# Altium schematic sheet [28] - PWR 1V375 OPT, 3V3 OPT.SchDoc
size A2; DocumentNumber: 27; SheetNumber: 27; SheetTotal: 32
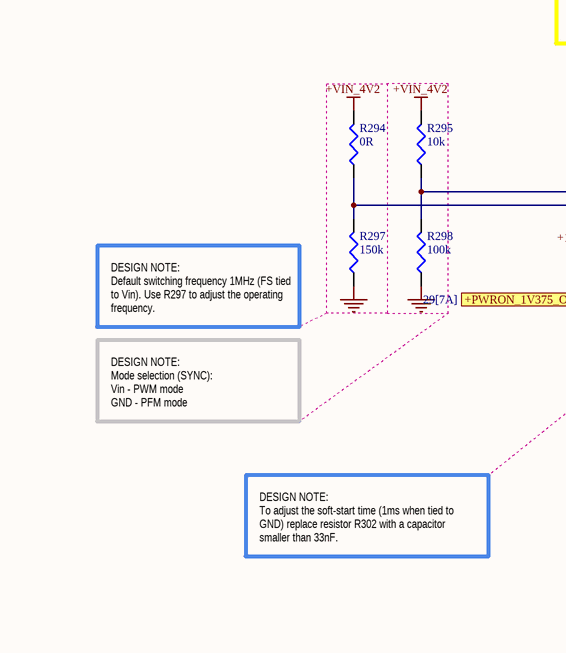
[diagram p0: [28] - PWR 1V375 OPT, 3V3 OPT.SchDoc, top left]
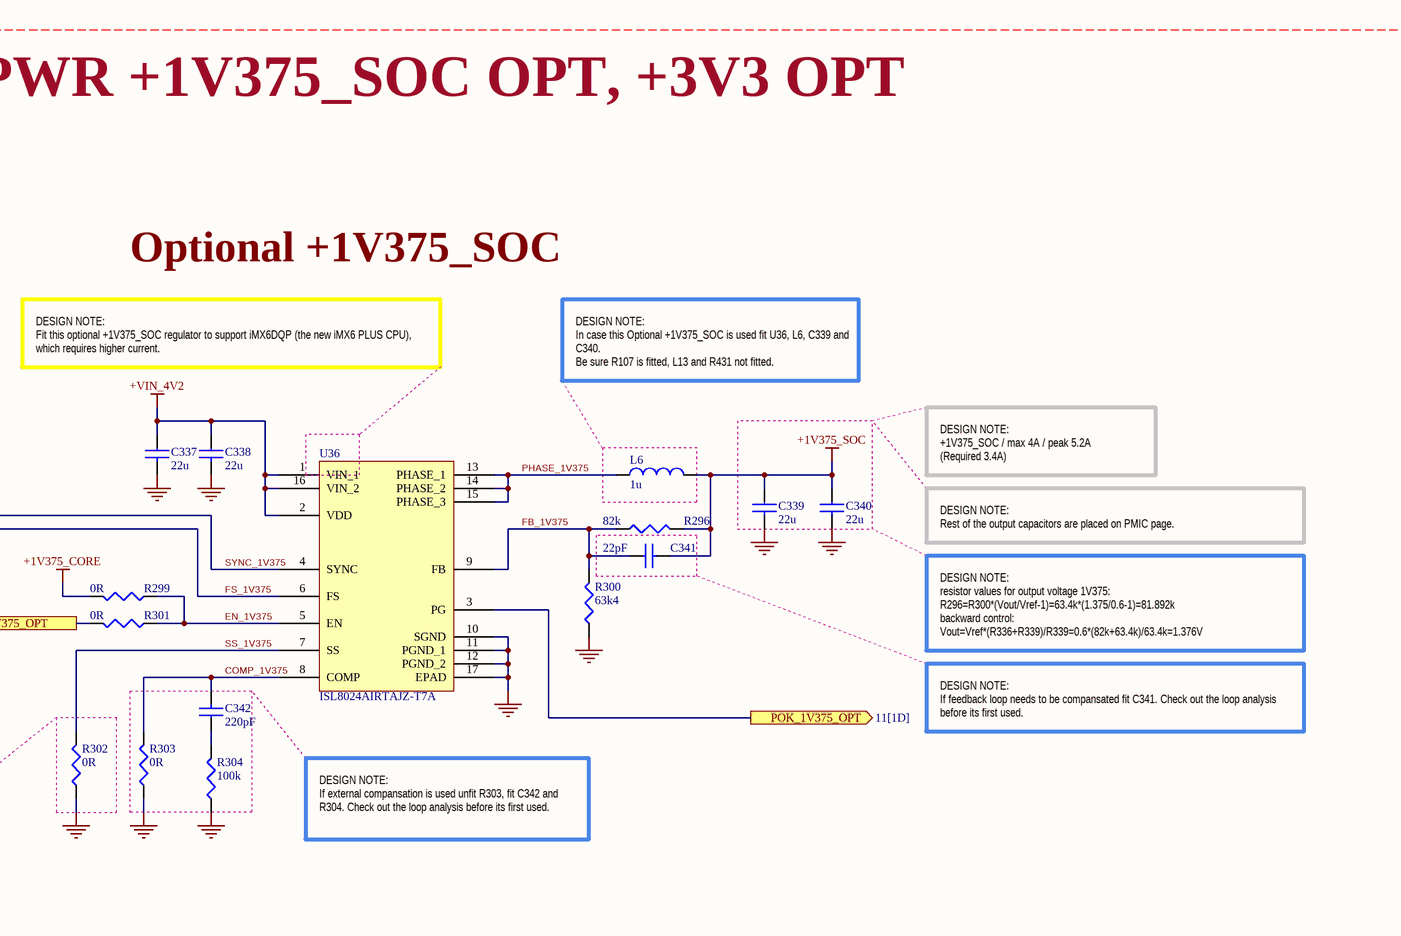
[diagram p1: [28] - PWR 1V375 OPT, 3V3 OPT.SchDoc, top right]
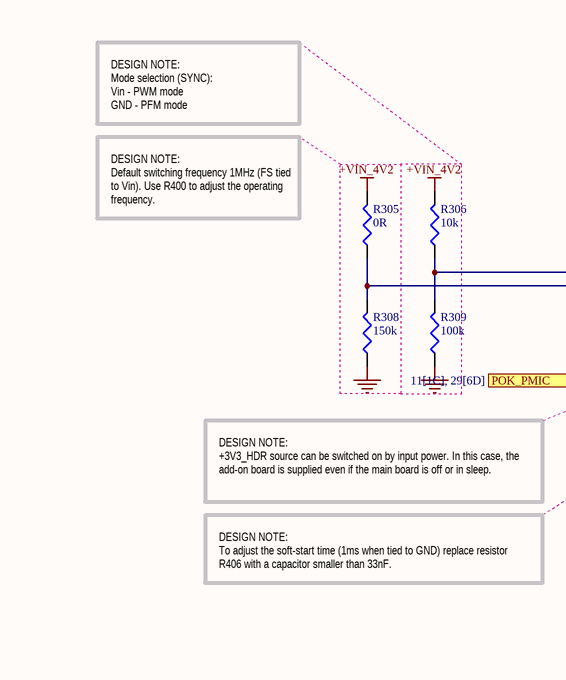
[diagram p2: [28] - PWR 1V375 OPT, 3V3 OPT.SchDoc, bottom left]
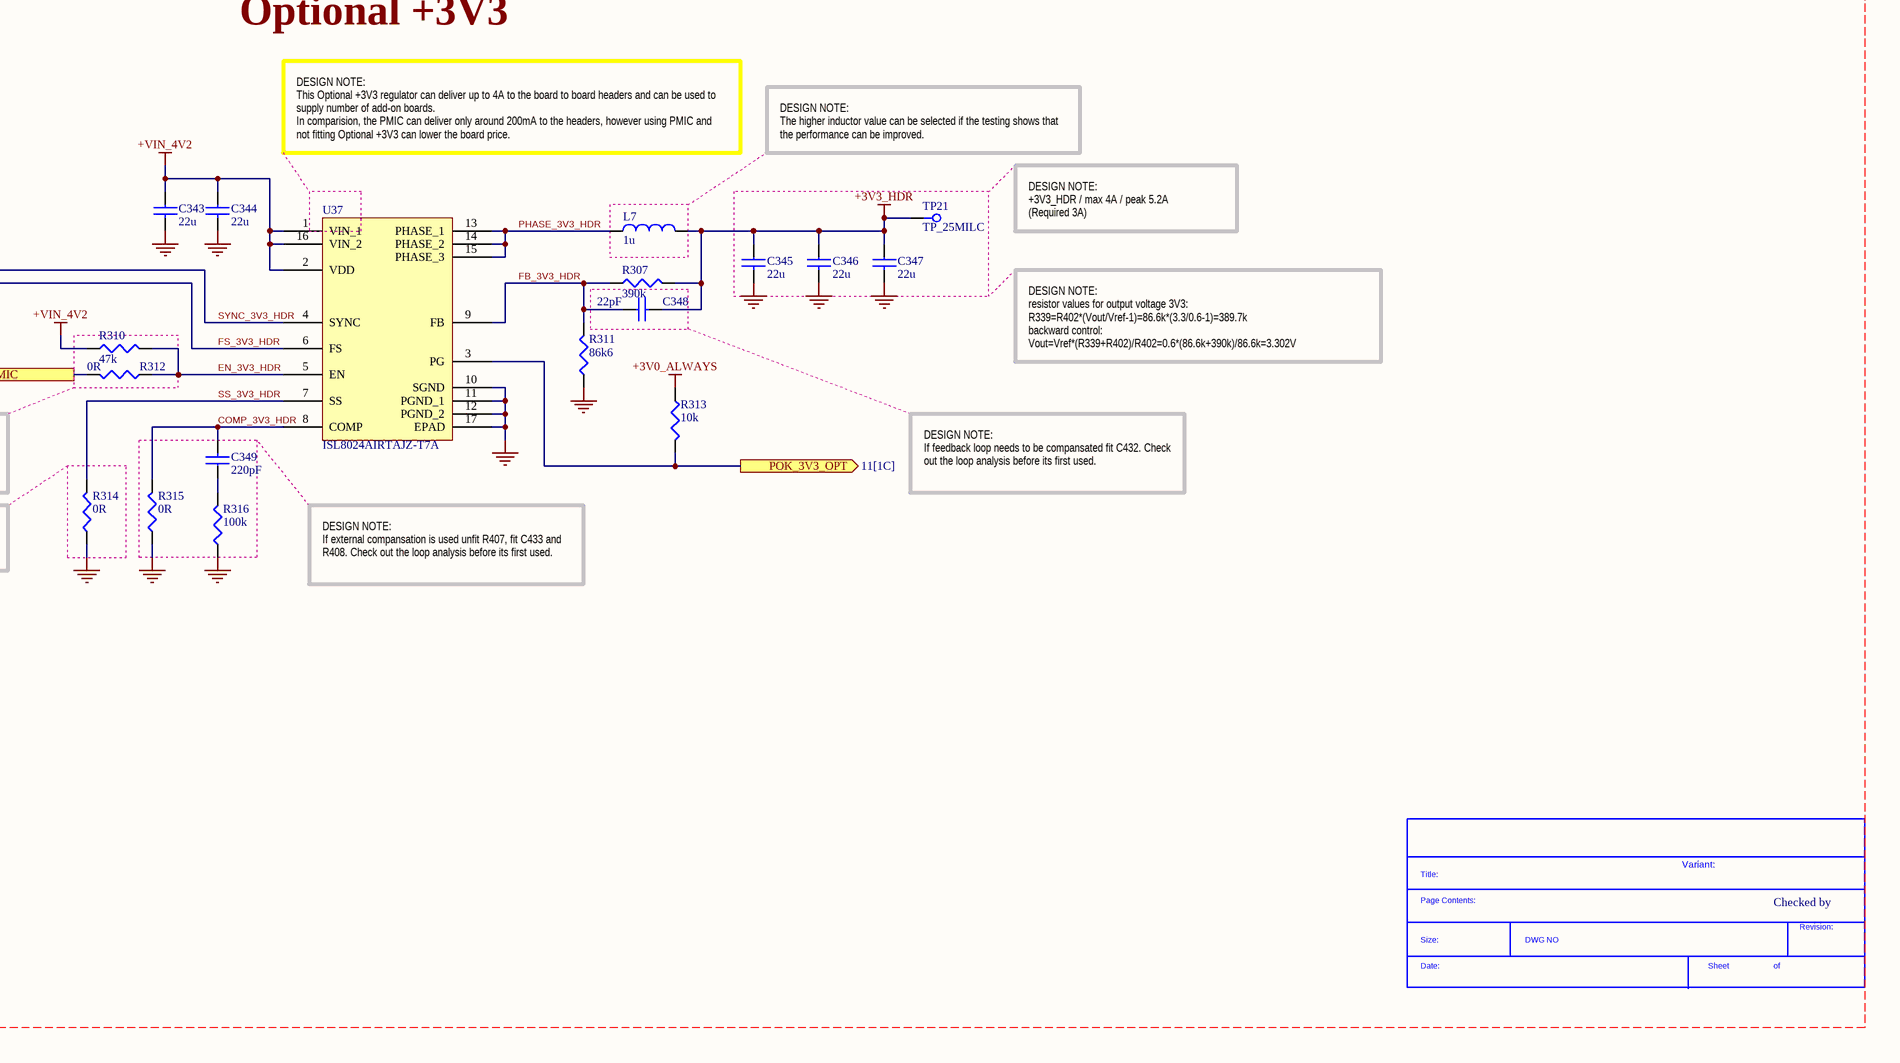
[diagram p3: [28] - PWR 1V375 OPT, 3V3 OPT.SchDoc, bottom right]

## Parts
*  SDTitleBlock  (value not drawn)  (graphical)
C337  22u  [C0603]
C338  22u  [C0603]
C339  22u  [C0603]
C340  22u  [C0603]
C341  22pF  [C0402]
C342  220pF  [C0402]
C343  22u  [C0603]
C344  22u  [C0603]
C345  22u  [C0603]
C346  22u  [C0603]
C347  22u  [C0603]
C348  22pF  [C0402]
C349  220pF  [C0402]
L6  1u  [IHLP_204MILX216MIL]
L7  1u  [IHLP_204MILX216MIL]
R294  0R  [R0402]
R295  10k  [R0402]
R296  82k  [R0402]
R297  150k  [R0402]
R298  100k  [R0402]
R299  0R  [R0402]
R300  63k4  [R0402]
R301  0R  [R0402]
R302  0R  [R0402]
R303  0R  [R0402]
R304  100k  [R0402]
R305  0R  [R0402]
R306  10k  [R0402]
R307  390k  [R0402]
R308  150k  [R0402]
R309  100k  [R0402]
R310  47k  [R0402]
R311  86k6  [R0402]
R312  0R  [R0402]
R313  10k  [R0402]
R314  0R  [R0402]
R315  0R  [R0402]
R316  100k  [R0402]
TP21  TP_25MILC  [TP_25C]  (no BOM)
U36  ISL8024AIRTAJZ-T7A  [16-TQFN_3mmx3mm_V1.1]
U37  ISL8024AIRTAJZ-T7A  [16-TQFN_3mmx3mm_V1.1]

## Ports
+PWRON_1V375_OPT (see 29[7A]), POK_1V375_OPT (out, see 11[1D]), POK_3V3_OPT (out, see 11[1C]), POK_PMIC (see 11[1C], 29[6D])

## Nets
+1V375_CORE: R299.2
+1V375_SOC: C339.1 C340.1 C341.2 L6.2 R296.2
+3V0_ALWAYS: R313.1
+3V3_HDR: C345.1 C346.1 C347.1 C348.2 L7.2 R307.2 TP21.1
+VIN_4V2: C337.1 C338.1 C343.1 C344.1 R294.2 R295.2 R305.2 R306.2 R310.1 U36.1(VIN_1) U36.2(VDD) U36.16(VIN_2) U37.1(VIN_1) U37.2(VDD) U37.16(VIN_2)
GND: C337.2 C338.2 C339.2 C340.2 C343.2 C344.2 C345.2 C346.2 C347.2 R297.1 R298.1 R300.1 R302.1 R303.1 R304.1 R308.1 R309.1 R311.1 R314.1 R315.1 R316.1 U36.10(SGND) U36.11(PGND_1) U36.12(PGND_2) U36.17(EPAD) U37.10(SGND) U37.11(PGND_1) U37.12(PGND_2) U37.17(EPAD)
+PWRON_1V375_OPT: R301.2 ; port +PWRON_1V375_OPT
COMP_1V375: C342.2 R303.2 U36.8(COMP)
COMP_3V3_HDR: C349.2 R315.2 U37.8(COMP)
EN_1V375: R299.1 R301.1 U36.5(EN)
EN_3V3_HDR: R310.2 R312.1 U37.5(EN)
FB_1V375: C341.1 R296.1 R300.2 U36.9(FB)
FB_3V3_HDR: C348.1 R307.1 R311.2 U37.9(FB)
FS_1V375: R294.1 R297.2 U36.6(FS)
FS_3V3_HDR: R305.1 R308.2 U37.6(FS)
PHASE_1V375: L6.1 U36.13(PHASE_1) U36.14(PHASE_2) U36.15(PHASE_3)
PHASE_3V3_HDR: L7.1 U37.13(PHASE_1) U37.14(PHASE_2) U37.15(PHASE_3)
POK_1V375_OPT: U36.3(PG) ; port POK_1V375_OPT
POK_3V3_OPT: R313.2 U37.3(PG) ; port POK_3V3_OPT
POK_PMIC: R312.2 ; port POK_PMIC
SS_1V375: R302.2 U36.7(SS)
SS_3V3_HDR: R314.2 U37.7(SS)
SYNC_1V375: R295.1 R298.2 U36.4(SYNC)
SYNC_3V3_HDR: R306.1 R309.2 U37.4(SYNC)
NetC342_1: C342.1 R304.2
NetC349_1: C349.1 R316.2

## Layout directives
net class [27] - PWR 1V375 OPT/3V3 OPT: +1V375_CORE, +1V375_SOC, +3V0_ALWAYS, +3V3_HDR, +VIN_4V2, COMP_1V375, COMP_3V3_HDR, EN_1V375, EN_3V3_HDR, FB_1V375, FB_3V3_HDR, FS_1V375, FS_3V3_HDR, GND, PHASE_1V375, PHASE_3V3_HDR, SS_1V375, SS_3V3_HDR, SYNC_1V375, SYNC_3V3_HDR

## Notes on the sheet
- PWR +1V375_SOC OPT, +3V3 OPT
- Optional +1V375_SOC
- DESIGN NOTE:
  Fit this optional +1V375_SOC regulator to support iMX6DQP (the new iMX6 PLUS CPU), which requires higher current.
- DESIGN NOTE:
  In case this Optional +1V375_SOC is used fit U36, L6, C339 and C340.
  Be sure R107 is fitted, L13 and R431 not fitted.
- DESIGN NOTE:
  +1V375_SOC / max 4A / peak 5.2A
  (Required 3.4A)
- DESIGN NOTE:
  Rest of the output capacitors are placed on PMIC page.
- DESIGN NOTE:
  Default switching frequency 1MHz (FS tied to Vin). Use R297 to adjust the operating frequency.
- DESIGN NOTE:
  resistor values for output voltage 1V375:
  R296=R300*(Vout/Vref-1)=63.4k*(1.375/0.6-1)=81.892k
  backward control:
  Vout=Vref*(R336+R339)/R339=0.6*(82k+63.4k)/63.4k=1.376V
- DESIGN NOTE:
  Mode selection (SYNC):
  Vin - PWM mode
  GND - PFM mode
- DESIGN NOTE:
  If feedback loop needs to be compansated fit C341. Check out the loop analysis before its first used.
- DESIGN NOTE:
  If external compansation is used unfit R303, fit C342 and R304. Check out the loop analysis before its first used.
- DESIGN NOTE:
  To adjust the soft-start time (1ms when tied to GND) replace resistor R302 with a capacitor smaller than 33nF.
- Optional +3V3
- DESIGN NOTE:
  This Optional +3V3 regulator can deliver up to 4A to the board to board headers and can be used to supply number of add-on boards.
  In comparision, the PMIC can deliver only around 200mA to the headers, however using PMIC and not fitting Optional +3V3 can lower the board price.
- DESIGN NOTE:
  The higher inductor value can be selected if the testing shows that the performance can be improved.
- DESIGN NOTE:
  Default switching frequency 1MHz (FS tied to Vin). Use R400 to adjust the operating frequency.
- DESIGN NOTE:
  +3V3_HDR / max 4A / peak 5.2A
  (Required 3A)
- DESIGN NOTE:
  resistor values for output voltage 3V3:
  R339=R402*(Vout/Vref-1)=86.6k*(3.3/0.6-1)=389.7k
  backward control:
  Vout=Vref*(R339+R402)/R402=0.6*(86.6k+390k)/86.6k=3.302V
- DESIGN NOTE:
  +3V3_HDR source can be switched on by input power. In this case, the add-on board is supplied even if the main board is off or in sleep.
- DESIGN NOTE:
  If feedback loop needs to be compansated fit C432. Check out the loop analysis before its first used.
- DESIGN NOTE:
  To adjust the soft-start time (1ms when tied to GND) replace resistor R406 with a capacitor smaller than 33nF.
- DESIGN NOTE:
  If external compansation is used unfit R407, fit C433 and R408. Check out the loop analysis before its first used.
- Variant:
- Checked by
- (in symbol SDTitleBlock) Title:; Page Contents:; Revision:; Size:; DWG NO; Date:; Sheet; of

## Library data of the parts
C337 C338 C343 C344 = C1608X5R0J226M080AC: CAP CER 22UF 6.3V 20% X5R 0603; Manufacturer: TDK Corporation; Capacitance: 22µF; .Creator: MM; .Checked PCB: used; Supplier 1: Digi-Key; Manufacturer Part Number: C1608X5R0J226M080AC; RoHS: RoHS Compliant; Category: Capacitors; Stock 1: 593047; Pricing 1: 1=0.39, 10=0.343, 100=0.1714, 250=0.13708, 500=0.12484, 1000=0.1104 (USD); Packaging: Cut Tape (CT); Tolerance: ±20%; Voltage - Rated: 6.3V; Temperature Coefficient: X5R; Mounting Type: Surface Mount, MLCC; Operating Temperature: -55°C ~ 85°C; Applications: General Purpose; Ratings: -; Package / Case: 0603 (1608 Metric); Size / Dimension: 0.063" L x 0.031" W (1.60mm x 0.80mm); Height - Seated (Max): -; Thickness (Max): 0.039" (1.00mm); Lead Spacing: -; Features: -; Lead Style: -; ComponentLink1URL: http://product.tdk.com/en/catalog/datasheets/mlcc_commercial_general_en.pdf; ComponentLink1Description: http://product.tdk.com/en/catalog/datasheets/mlcc_commercial_general_en.pdf; Supplier Part Number 1: 445-8028-1-ND; .Checked SCH: used
C339 C340 C345-C347 = GRM188R60G226MEA0L: CAP CER 22UF 4V 20% X5R 0603; Manufacturer: Murata Electronics North America; Capacitance: 22µF; .Checked PCB: used; .Creator: MM; Supplier 1: Digi-Key; Supplier Part Number 1: 490-5526-1-ND; Manufacturer Part Number: GRM188R60G226MEA0L; RoHS: RoHS Compliant; Category: Capacitors; Stock 1: 5760; Pricing 1: 1=0.79, 10=0.663, 50=0.4752, 100=0.4158, 250=0.32672, 500=0.297, 1000=0.2376 (USD); Voltage - Rated: 4V; Tolerance: ±20%; Temperature Coefficient: X5R; Mounting Type: Surface Mount, MLCC; Operating Temperature: -55°C ~ 85°C; Applications: General Purpose; Ratings: -; Package / Case: 0603 (1608 Metric); Size / Dimension: 0.063" L x 0.031" W (1.60mm x 0.80mm); Height - Seated (Max): -; Thickness (Max): 0.035" (0.90mm); Lead Spacing: -; Features: -; Packaging: Cut Tape (CT); Lead Style: -; ComponentLink1URL: http://www.murata.com/products/catalog/pdf/c02e.pdf; ComponentLink1Description: http://www.murata.com/products/catalog/pdf/c02e.pdf; .Checked SCH: used
C341 C348 = C1005C0G1H220J: CAP CER 22PF 50V C0G 5% 0402; Manufacturer: TDK Corporation; .Checked PCB: used; Temperature Coefficient: C0G, NP0; Capacitance: 22pF; Category: Capacitors; Supplier Part Number: 445-1239-1-ND; Manufacturer Part Number: C1005C0G1H220J; Operating Temperature: -55°C ~ 125°C; Package / Case: 0402 (1005 Metric); Price 1k [$]: 0.00442; Value: 22pF; .Checked SCH: used; Voltage - Rated: 50V; Supplier: Digikey; Supplier 1: Digi-Key; Supplier Part Number 1: 445-1239-1-ND; RoHS: RoHS Compliant; Stock 1: 176261; Pricing 1: 1=0.08, 10=0.05, 100=0.018, 250=0.013, 500=0.0096, 1000=0.0065 (USD); Tolerance: ±5%; Mounting Type: Surface Mount, MLCC; Applications: General Purpose; Ratings: -; Size / Dimension: 0.039" L x 0.020" W (1.00mm x 0.50mm); Height - Seated (Max): -; Thickness (Max): 0.022" (0.55mm); Lead Spacing: -; Features: -; Packaging: Cut Tape (CT); Lead Style: -; ComponentLink1URL: http://www.tdk.co.jp/tefe02/e412_c.pdf; ComponentLink1Description: http://www.tdk.co.jp/tefe02/e412_c.pdf
C342 C349 = C1005X7R1H221K: CAP CER 220PF 50V X7R 10% 0402; Manufacturer: TDK Corporation; .Checked PCB: used; Capacitance: 220pF; Category: Capacitors; Supplier Part Number: 445-1254-1-ND; Manufacturer Part Number: C1005X7R1H221K; Operating Temperature: -55°C ~ 125°C; Package / Case: 0402 (1005 Metric); Price 1k [$]: 0.00650; Value: 220pF; .Checked SCH: used; Voltage - Rated: 50V; Supplier: Digikey; Supplier 1: Digi-Key; Supplier Part Number 1: 445-1254-1-ND; RoHS: RoHS Compliant; Stock 1: 212041; Pricing 1: 1=0.08, 10=0.05, 100=0.018, 250=0.013, 500=0.0096, 1000=0.0065 (USD); Tolerance: ±10%; Temperature Coefficient: X7R; Mounting Type: Surface Mount, MLCC; Applications: General Purpose; Ratings: -; Size / Dimension: 0.039" L x 0.020" W (1.00mm x 0.50mm); Height - Seated (Max): -; Thickness (Max): 0.022" (0.55mm); Lead Spacing: -; Features: -; Packaging: Cut Tape (CT); Lead Style: -; ComponentLink1URL: http://www.tdk.co.jp/tefe02/e412_c.pdf; ComponentLink1Description: http://www.tdk.co.jp/tefe02/e412_c.pdf; Supplier 2: Digi-Key; Supplier Part Number 2: 399-14273-1-ND
L6 L7 = IHLP2020BZER1R0M11: INDUCTOR POWER 1.0UH 7.5A SMD; Manufacturer: Vishay Dale; Type: Molded; Inductance: 1µH; Tolerance: ±20%; Current - Saturation: 7A; Shielding: Shielded; DC Resistance (DCR): 18.1 mOhm Max; Frequency - Self Resonant: 66MHz; Frequency - Test: 100kHz; .Checked PCB: used; .Creator: MM; Supplier 1: Digi-Key; Manufacturer Part Number: IHLP2020BZER1R0M11; RoHS: RoHS Compliant; Category: Inductors, Coils, Chokes; Stock 1: 8442; Pricing 1: 1=2.4, 10=2.24, 100=1.664, 500=1.408, 1000=1.312 (USD); Packaging: Cut Tape (CT); Material - Core: -; Current Rating: 7.5A; Q @ Freq: -; Operating Temperature: -55°C ~ 125°C; Mounting Type: Surface Mount; Package / Case: Non Standard; Size / Dimension: 0.216" L x 0.204" W (5.49mm x 5.18mm); Height - Seated (Max): 0.079" (2.00mm); Supplier Device Package: -; Supplier Part Number 1: 541-1218-1-ND; .Checked SCH: used
R294 R299 R301-R303 R305 R312 R314 R315 = RC0402JR-070RL: RES 0.0 OHM 1/16W 0402 SMD; Manufacturer: Yageo; Resistance (Ohms): 0.0; Power (Watts): 0.063W, 1/16W; Tolerance: Jumper; .Checked PCB: used; Category: Resistors; Supplier Part Number: 311-0.0JRCT-ND; Manufacturer Part Number: RC0402JR-070RL; Package / Case: 0402 (1005 Metric); Price 1k [$]: 0.01389; Value: 0R; .Checked SCH: used; Supplier: Digikey; Supplier 1: Digi-Key; Supplier Part Number 1: 311-0.0JRCT-ND; RoHS: RoHS Compliant; Stock 1: 1106330; Pricing 1: 10=0.012, 50=0.009, 100=0.0069, 250=0.00512, 500=0.0038, 1000=0.00253 (USD); Composition: Thick Film; Features: -; Temperature Coefficient: -; Size / Dimension: 0.039" L x 0.020" W (1.00mm x 0.50mm); Height: 0.016" (0.40mm); Number of Terminations: 2; Packaging: Cut Tape (CT); ComponentLink1URL: http://www.yageo.com/documents/recent/PYu-RC0402_51_RoHS_L_6.pdf; ComponentLink1Description: http://www.yageo.com/documents/recent/PYu-RC0402_51_RoHS_L_6.pdf
R295 R306 R313 = RC0402FR-0710KL: RES 10.0K OHM 1/16W 1% 0402 SMD; Manufacturer: Yageo; Power (Watts): 0.063W, 1/16W; .Checked PCB: used; Temperature Coefficient: ±100ppm/°C; Category: Resistors; Supplier Part Number: 311-10.0KLRCT-ND; Manufacturer Part Number: RC0402FR-0710KL; Package / Case: 0402 (1005 Metric); Price 1k [$]: 0.01421; Resistance (Ohms): 10K; Tolerance: ±1%; Value: 10k; .Checked SCH: used; Supplier: Digikey; Supplier 1: Digi-Key; Supplier Part Number 1: 311-10.0KLRCT-ND; RoHS: RoHS Compliant; Stock 1: 2916495; Pricing 1: 10=0.014, 50=0.0104, 100=0.0079, 250=0.00584, 500=0.00432, 1000=0.00288 (USD); Composition: Thick Film; Features: -; Size / Dimension: 0.039" L x 0.020" W (1.00mm x 0.50mm); Height: 0.016" (0.40mm); Number of Terminations: 2; Packaging: Cut Tape (CT); ComponentLink1URL: http://www.yageo.com/documents/recent/PYu-RC0402_51_RoHS_L_6.pdf; ComponentLink1Description: http://www.yageo.com/documents/recent/PYu-RC0402_51_RoHS_L_6.pdf
R296 = RC0402FR-0782KL: RES 82.0K OHM 1/16W 1% 0402 SMD; Manufacturer: Yageo; Power (Watts): 0.063W, 1/16W; Temperature Coefficient: ±100ppm/°C; .Creator: MM; .Checked PCB: used; Supplier 1: Digi-Key; Manufacturer Part Number: RC0402FR-0782KL; RoHS: RoHS Compliant; Category: Resistors; Stock 1: 338; Pricing 1: 1=0.1, 10=0.015, 25=0.0108, 100=0.006, 250=0.00456, 500=0.00364, 1000=0.00268, 2500=0.00233, 5000=0.00192 (USD); Packaging: Cut Tape (CT); Resistance (Ohms): 82k; Tolerance: ±1%; Composition: Thick Film; Features: Moisture Resistant; Package / Case: 0402 (1005 Metric); Supplier Device Package: 0402; Size / Dimension: 0.039" L x 0.020" W (1.00mm x 0.50mm); Height: 0.016" (0.40mm); Number of Terminations: 2; ComponentLink1URL: http://www.yageo.com/documents/recent/PYu-RC0402_51_RoHS_L_6.pdf; ComponentLink1Description: http://www.yageo.com/documents/recent/PYu-RC0402_51_RoHS_L_6.pdf; Supplier Part Number 1: 311-82.0KLRCT-ND; .Checked SCH: used
R297 R308 = RC0402FR-07150KL: RES 150K OHM 1/16W 1% 0402 SMD; Manufacturer: Yageo; Power (Watts): 0.063W, 1/16W; Temperature Coefficient: ±100ppm/°C; .Creator: MM; .Checked PCB: used; Supplier 1: Digi-Key; Manufacturer Part Number: RC0402FR-07150KL; RoHS: RoHS Compliant; Category: Resistors; Stock 1: 612629; Pricing 1: 1=0.1, 10=0.015, 25=0.0108, 100=0.006, 250=0.00456, 500=0.00364, 1000=0.00268, 2500=0.00233, 5000=0.00192 (USD); Packaging: Cut Tape (CT); Resistance (Ohms): 150k; Tolerance: ±1%; Composition: Thick Film; Features: Moisture Resistant; Package / Case: 0402 (1005 Metric); Supplier Device Package: 0402; Size / Dimension: 0.039" L x 0.020" W (1.00mm x 0.50mm); Height: 0.016" (0.40mm); Number of Terminations: 2; ComponentLink1URL: http://www.yageo.com/documents/recent/PYu-RC0402_51_RoHS_L_6.pdf; ComponentLink1Description: http://www.yageo.com/documents/recent/PYu-RC0402_51_RoHS_L_6.pdf; Supplier Part Number 1: 311-150KLRCT-ND; .Checked SCH: used
R298 R304 R309 R316 = RMCF0402FT100K: RES 100K OHM 1/16W 1% 0402 SMD; Manufacturer: Stackpole Electronics Inc; Power (Watts): 0.063W, 1/16W; .Checked PCB: used; Temperature Coefficient: ±100ppm/°C; Category: Resistors; Supplier Part Number: RMCF0402FT100KCT-ND; Manufacturer Part Number: RMCF0402FT100K; Package / Case: 0402 (1005 Metric); Price 1k [$]: 0.00384; Resistance (Ohms): 100K; Tolerance: ±1%; Value: 100k; .Checked SCH: used; Supplier: Digikey; Supplier 1: Digi-Key; Supplier Part Number 1: YAG1343DKR-ND; RoHS: RoHS Compliant; Composition: Thick Film; Features: -; Size / Dimension: 0.039" L x 0.020" W (1.00mm x 0.50mm); Height: 0.016" (0.40mm); Number of Terminations: 2; Packaging: Cut Tape (CT); ComponentLink1URL: http://www.seielect.com/Catalog/SEI-RMCF.pdf; ComponentLink1Description: http://www.seielect.com/Catalog/SEI-RMCF.pdf
R300 = CRCW040263K4FKED: RES SMD 63.4K OHM 1% 1/16W 0402; Manufacturer: Vishay Dale; Power (Watts): 0.063W, 1/16W; Temperature Coefficient: ±100ppm/°C; .Checked PCB: used; .Creator: MM; Supplier 1: Digi-Key; Manufacturer Part Number: CRCW040263K4FKED; RoHS: RoHS Compliant; Category: Resistors; Stock 1: 43534; Pricing 1: 10=0.083, 50=0.0444, 200=0.0255, 1000=0.0174 (USD); Packaging: Cut Tape (CT); Resistance (Ohms): 63.4k; Tolerance: ±1%; Composition: Thick Film; Features: Automotive AEC-Q200; Operating Temperature: -55°C ~ 155°C; Package / Case: 0402 (1005 Metric); Supplier Device Package: 0402 (1005 Metric); Size / Dimension: 0.039" L x 0.020" W (1.00mm x 0.50mm); Height: 0.016" (0.40mm); Number of Terminations: 2; ComponentLink1URL: http://www.vishay.com/docs/20035/dcrcwe3.pdf; ComponentLink1Description: http://www.vishay.com/docs/20035/dcrcwe3.pdf; Supplier Part Number 1: 541-63.4KLCT-ND; .Checked SCH: used; Supplier 2: Digi-Key; Supplier Part Number 2: P63.4KDCCT-ND
R307 = CRCW0402390KFKED: RES 390K OHM 1/16W 1% 0402 SMD; Manufacturer: Vishay Dale; Power (Watts): 0.063W, 1/16W; Temperature Coefficient: ±100ppm/°C; .Creator: MM; .Checked SCH: used; Supplier 1: Digi-Key; Manufacturer Part Number: CRCW0402390KFKED; RoHS: RoHS Compliant; Category: Resistors; Stock 1: 288225; Pricing 1: 10=0.083, 50=0.0444, 200=0.0255, 1000=0.0174 (USD); Packaging: Cut Tape (CT); Resistance (Ohms): 390k; Tolerance: ±1%; Composition: Thick Film; Features: Automotive AEC-Q200 Qualified; Package / Case: 0402 (1005 Metric); Supplier Device Package: 0402 (1005 Metric); Size / Dimension: 0.039" L x 0.020" W (1.00mm x 0.50mm); Height: 0.016" (0.40mm); Number of Terminations: 2; ComponentLink1URL: http://www.vishay.com/docs/20035/dcrcwe3.pdf; ComponentLink1Description: http://www.vishay.com/docs/20035/dcrcwe3.pdf; Supplier Part Number 1: 541-390KLCT-ND; .Checked PCB: used; Supplier 2: Digi-Key; Supplier Part Number 2: YAG3143CT-ND
R310 = RC0402FR-0747KL: RES 47.0K OHM 1/16W 1% 0402 SMD; Manufacturer: Yageo; Power (Watts): 0.063W, 1/16W; .Checked PCB: used; Temperature Coefficient: ±100ppm/°C; Category: Resistors; Supplier Part Number: 311-47.0KLRCT-ND; Manufacturer Part Number: RC0402FR-0747KL; Package / Case: 0402 (1005 Metric); Price 1k [$]: 0.01421; Resistance (Ohms): 47K; Tolerance: ±1%; Value: 47k; .Checked SCH: used; Supplier: Digikey; Supplier 1: Digi-Key; Supplier Part Number 1: 311-47.0KLRCT-ND; RoHS: RoHS Compliant; Stock 1: 1227580; Pricing 1: 10=0.014, 50=0.0104, 100=0.0079, 250=0.00584, 500=0.00432, 1000=0.00288 (USD); Composition: Thick Film; Features: -; Size / Dimension: 0.039" L x 0.020" W (1.00mm x 0.50mm); Height: 0.016" (0.40mm); Number of Terminations: 2; Packaging: Cut Tape (CT); ComponentLink1URL: http://www.yageo.com/documents/recent/PYu-RC0402_51_RoHS_L_6.pdf; ComponentLink1Description: http://www.yageo.com/documents/recent/PYu-RC0402_51_RoHS_L_6.pdf; Supplier 2: Digi-Key; Supplier Part Number 2: 1276-3467-1-ND
R311 = RC0402FR-0786K6L: RES SMD 86.6K OHM 1% 1/16W 0402; Manufacturer: Yageo; Power (Watts): 0.063W, 1/16W; Temperature Coefficient: ±100ppm/°C; .Creator: MM; .Checked PCB: used; Supplier 1: Digi-Key; Manufacturer Part Number: RC0402FR-0786K6L; RoHS: RoHS Compliant; Category: Resistors; Stock 1: 7980; Pricing 1: 1=0.1, 10=0.012, 25=0.0084, 100=0.0048, 250=0.00368, 500=0.00294, 1000=0.00216, 2500=0.00187, 5000=0.00155 (USD); Packaging: Cut Tape (CT); Resistance (Ohms): 86.6k; Tolerance: ±1%; Composition: Thick Film; Features: Moisture Resistant; Operating Temperature: -55°C ~ 155°C; Package / Case: 0402 (1005 Metric); Supplier Device Package: 0402; Size / Dimension: 0.040" L x 0.020" W (1.00mm x 0.50mm); Height: 0.016" (0.40mm); Number of Terminations: 2; ComponentLink1URL: http://www.yageo.com/NewPortal/yageodocoutput?fileName=/pdf/R-Chip/PYu-RC_Group_51_RoHS_L_3.pdf; ComponentLink1Description: http://www.yageo.com/NewPortal/yageodocoutput?fileName=/pdf/R-Chip/PYu-RC_Group_51_RoHS_L_3.pdf; Supplier Part Number 1: YAG3249CT-ND; .Checked SCH: used
TP21 = TP_25MILC: Test Point 25mil; .Checked PCB: used
U36 U37 = ISL8024AIRTAJZ-T7A: IC REG BUCK SYNC ADJ 4A 16TQFN; Manufacturer: Intersil; Output Type: Adjustable; Number of Outputs: 1; Voltage - Output: 0.6 V ~ 5.5 V; Voltage - Input: 2.7 V ~ 5.5 V; Frequency - Switching: 490kHz ~ 4.2MHz; Synchronous Rectifier: Yes; .Creator: MM; .Checked PCB: used; Supplier 1: Digi-Key; Manufacturer Part Number: ISL8024AIRTAJZ-T7A; RoHS: RoHS Compliant; Category: Integrated Circuits (ICs); Stock 1: 440; Pricing 1: 1=4.61, 25=3.63, 100=3.08 (USD); Packaging: Cut Tape (CT); Type: Step-Down (Buck); Current - Output: 4A; Operating Temperature: -40°C ~ 85°C; Mounting Type: Surface Mount; Package / Case: 16-WFQFN Exposed Pad; Supplier Device Package: 16-TQFN (3x3); ComponentLink1URL: http://www.intersil.com/content/dam/Intersil/documents/fn78/fn7812.pdf; ComponentLink1Description: http://www.intersil.com/content/dam/Intersil/documents/fn78/fn7812.pdf; Supplier Part Number 1: ISL8024AIRTAJZ-T7ACT-ND; .Checked SCH: used